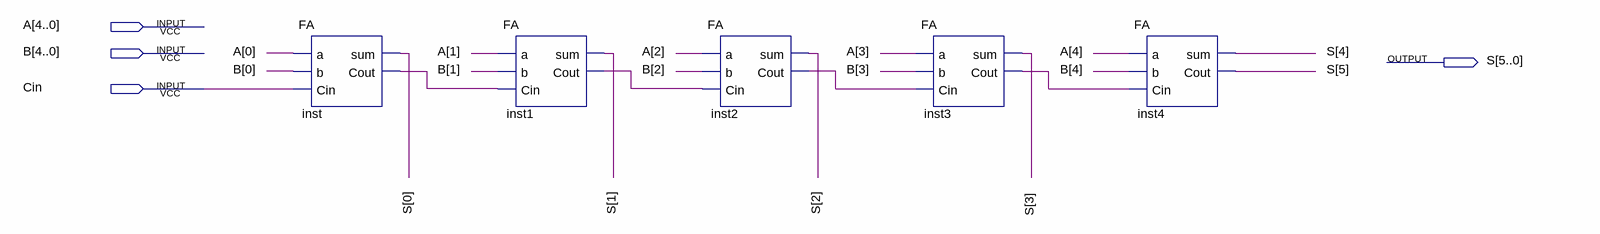
[diagram p0: schematic sheet]
// Quartus schematic 5badder.bdf as structural Verilog: 5 symbols, 4 pins
module \5badder  (
  input  [4:0] A,
  input  [4:0] B,
  input  Cin,
  output [5:0] S
);

  wire inst1_cout, inst2_cout, inst3_cout, inst_cout;

  FA inst (.a(A[0]), .b(B[0]), .Cin(Cin), .sum(S[0]), .Cout(inst_cout));
  FA inst1 (.a(A[1]), .b(B[1]), .Cin(inst_cout), .sum(S[1]), .Cout(inst1_cout));
  FA inst2 (.a(A[2]), .b(B[2]), .Cin(inst1_cout), .sum(S[2]), .Cout(inst2_cout));
  FA inst3 (.a(A[3]), .b(B[3]), .Cin(inst2_cout), .sum(S[3]), .Cout(inst3_cout));
  FA inst4 (.a(A[4]), .b(B[4]), .Cin(inst3_cout), .sum(S[4]), .Cout(S[5]));
endmodule
